# Altium schematic sheet ROBO HAND SCH.SchDoc
size A4; SheetNumber: 1; SheetTotal: 1
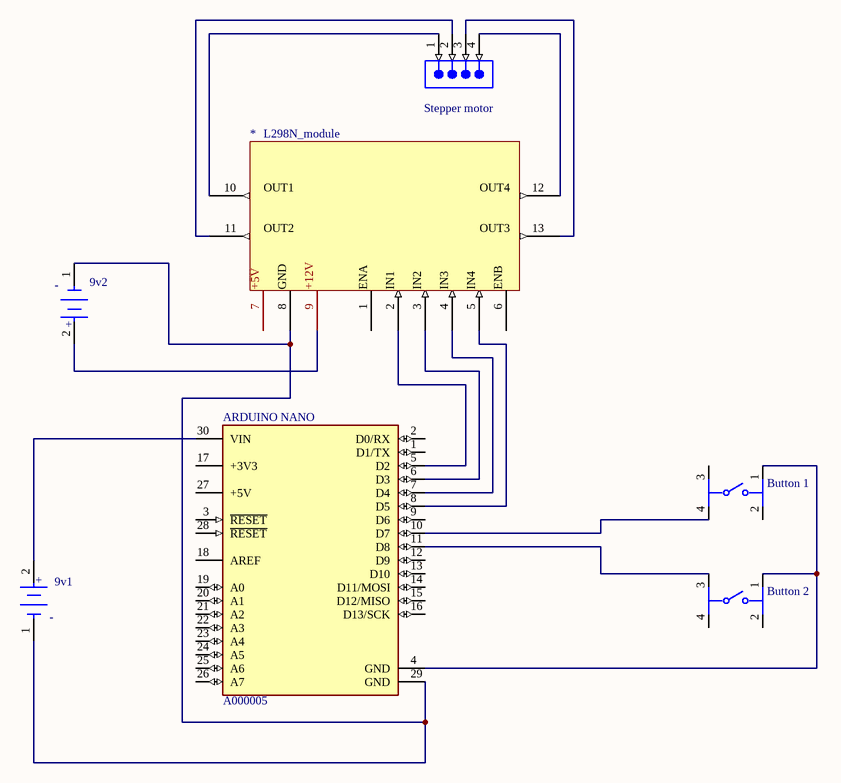
[diagram p0: ROBO HAND SCH.SchDoc]

## Parts
9v1  BH9VPC  [FP-BH9VPC-MFG]  (value not drawn)
9v2  BH9VPC  [FP-BH9VPC-MFG]  (value not drawn)
*  L298N_module
ARDUINO_NANO  A000005  [FP-A000005-MFG]
Button_1  PTS645SM43SMTR92LFS  [FP-PTS645SM43SMTR92LFS-MFG]  (value not drawn)
Button_2  PTS645SM43SMTR92LFS  [FP-PTS645SM43SMTR92LFS-MFG]  (value not drawn)
Stepper_motor  TSM-104-01-L-SH  [SMTC-TSM-104-01-X-SH]  (value not drawn)

## Nets
Net9v1_1: 9v1.1(C) 9v2.1(C) *.8(GND) ARDUINO_NANO.29(GND)
Net9v1_2: 9v1.2(A) ARDUINO_NANO.30(VIN)
Net9v2_2: 9v2.2(A) *.9(+12V)
Net*_2: *.2(IN1) ARDUINO_NANO.5(D2)
Net*_3: *.3(IN2) ARDUINO_NANO.6(D3)
Net*_4: *.4(IN3) ARDUINO_NANO.7(D4)
Net*_5: *.5(IN4) ARDUINO_NANO.8(D5)
Net*_10: *.10(OUT1) Stepper_motor.1(A+)
Net*_11: *.11(OUT2) Stepper_motor.2(A-)
Net*_12: *.12(OUT4) Stepper_motor.4(B-)
Net*_13: *.13(OUT3) Stepper_motor.3(B+)
NetARDUINO_NANO_4: ARDUINO_NANO.4(GND) Button_1.1 Button_2.1
NetARDUINO_NANO_10: ARDUINO_NANO.10(D7) Button_1.4
NetARDUINO_NANO_11: ARDUINO_NANO.11(D8) Button_2.3

Not connected (* = marked no-connect by the designer): * 1(ENA) 6(ENB) 7(+5V); ARDUINO_NANO 1(D1/TX) 2(D0/RX) 3(~{RESET}) 9(D6) 12(D9) 13(D10) 14(D11/MOSI) 15(D12/MISO) 16(D13/SCK) 17(+3V3) 18(AREF) 19(A0) 20(A1) 21(A2) 22(A3) 23(A4) 24(A5) 25(A6) 26(A7) 27(+5V) 28(~{RESET}); Button_1 2 3; Button_2 2 4

## Notes on the sheet
- (in symbol CMP-136216-000001-1) -; +

## Library data of the parts
9v1 9v2 = CMP-136216-000001-1: BATTERY HOLDER 9V PC PIN; Manufacturer: Memory Protection Devices; Description: Battery Holder (Open) 9V 1 Cell PC Pin; Conn Orientation: Vertical; Is Female: yes; Number Of Contacts: 2; Device Class L2: unset; Contact Material: Nickel; Device Class L1: Connectors; Lead Free: Yes; Digikey Description: BATTERY HOLDER 9V PC PIN; Category: Batt; ComponentLink2URL: http://www.memoryprotectiondevices.com/datasheets/BH9VPC-datasheet.pdf; Device Class L3: unset; Package: 0; Automotive: No; ComponentLink2Description: Datasheet; Height: 21.12mm; Voltage Rating: 9V; Octopart: https://octopart.com/bh9vpc-memory+protection+devices-22788154; RoHS: TRUE; Manufacturer Part Number: BH9VPC
ARDUINO_NANO = CMP-189986-000002-1: ARDUINO NANO ATMEGA328 EVAL BRD; Number of Bits: 8; Evaluation Kit: Yes; Operating Supply Voltage: 12V; Interface: I2C; Data Bus Width: 8b; Core Architecture: AVR; Packaging: Bulk; Length: 7inch; Package Quantity: 50; Width: 5inch; REACH SVHC: No SVHC; Weight: 0.358383oz; Series: AVR® ATmega; Height: 0.25inch
Button_1 Button_2 = CMP-2000-05160-2: SWITCH TACTILE SPST-NO 0.05A 12V; Contact Resistance: 100mR; Throw Configuration: SPST; Illumination Type: Non-Illuminated; Mechanical Life: 100000Cycles; Current Rating: 50mA; Switch Function: Off-Mom; Actuator Length: 0.85mm; Actuator Material: Nylon; Actuator Type: Standard; Operating Force: 160gf; Min Operating Temperature: -20°C; REACH SVHC: No SVHC; Termination: Gull Wing; Case/Package: SMD/SMT; Packaging: Tape and Reel; Mount: Surface Mount; Voltage Rating (DC): 12V; Orientation: Straight; Lead Free: Lead Free; Contact Material: Silver; Color: Black; Max Current Rating: 50mA; Contact Plating: Silver; Depth: 9mm; Package Quantity: 1; Max Voltage Rating (DC): 12V; Length: 6mm; Max Operating Temperature: 60°C
Stepper_motor = CMP-1024-00225-1: 0.025" SQ Post Header, Surface Mount, Horizontal, -55 to 125 degC, 2.54 mm Pitch, 4-Pin, Male, RoHS; Manufacturer: Samtec; Pitch: 2.54 mm; Orientation: Horizontal; DatasheetVersion: F-214; PackageVersion: CD, 7/1991; Temperature Range: -55 to 125 degC; ComponentLink2URL: http://www.samtec.com/documents/webfiles/pdf/TSM.PDF; ComponentLink3URL: http://www.samtec.com/documents/webfiles/cpdf/TSM-1XX-XX-XXX-SH-XX-XXX-XX-MKT1.pdf; PartNumber: TSM-104-01-L-SH; ComponentLink2Description: Datasheet; ComponentLink3Description: Package Specification; PackageReference: TSM-104-01-X-SH; PackageDescription: Terminal Strip Single Surface Mount; ComponentLink1Description: Manufacturer URL; RoHS: True; Mounting Technology: Surface Mount; ComponentLink1URL: http://www.samtec.com